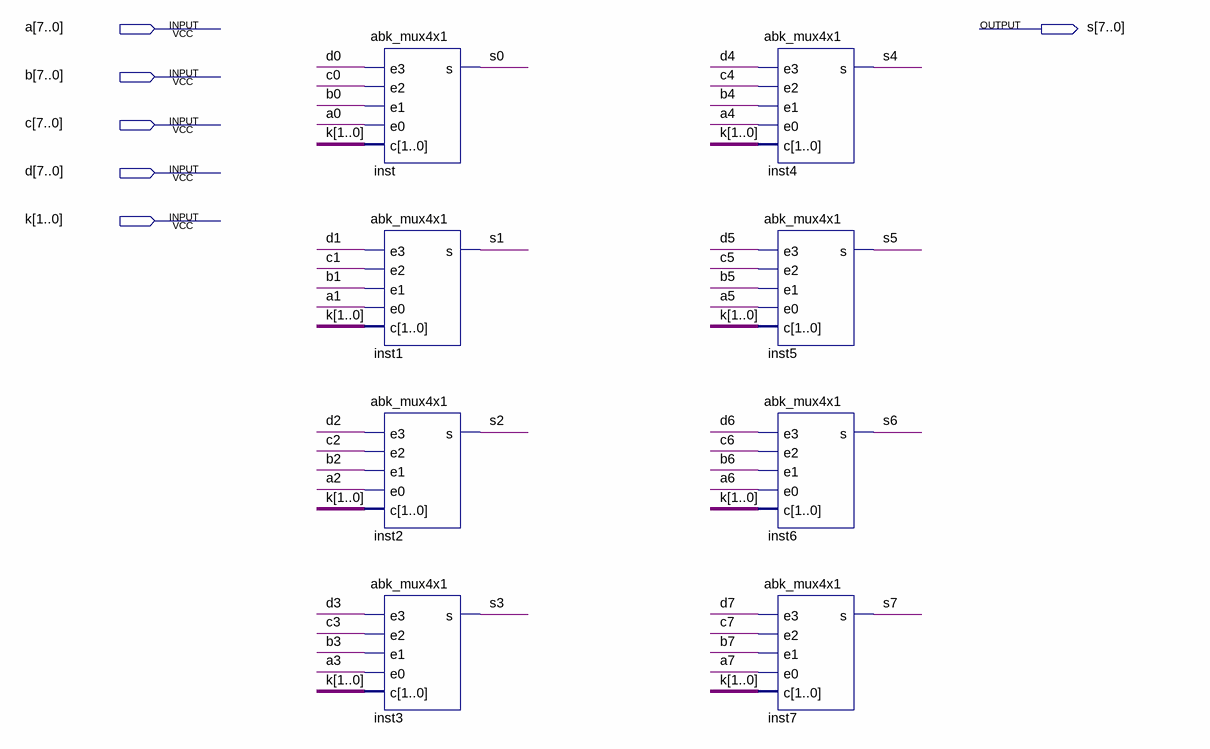
[diagram p0: schematic sheet]
// Quartus schematic abk_mux4x1_8.bdf as structural Verilog: 8 symbols, 6 pins
module abk_mux4x1_8 (
  input  [7:0] a,
  input  [7:0] b,
  input  [7:0] c,
  input  [7:0] d,
  input  [1:0] k,
  output [7:0] s
);

  abk_mux4x1 inst (.e3(d[0]), .e2(c[0]), .e1(b[0]), .e0(a[0]), .c(k), .s(s[0]));
  abk_mux4x1 inst1 (.e3(d[1]), .e2(c[1]), .e1(b[1]), .e0(a[1]), .c(k), .s(s[1]));
  abk_mux4x1 inst2 (.e3(d[2]), .e2(c[2]), .e1(b[2]), .e0(a[2]), .c(k), .s(s[2]));
  abk_mux4x1 inst3 (.e3(d[3]), .e2(c[3]), .e1(b[3]), .e0(a[3]), .c(k), .s(s[3]));
  abk_mux4x1 inst4 (.e3(d[4]), .e2(c[4]), .e1(b[4]), .e0(a[4]), .c(k), .s(s[4]));
  abk_mux4x1 inst5 (.e3(d[5]), .e2(c[5]), .e1(b[5]), .e0(a[5]), .c(k), .s(s[5]));
  abk_mux4x1 inst6 (.e3(d[6]), .e2(c[6]), .e1(b[6]), .e0(a[6]), .c(k), .s(s[6]));
  abk_mux4x1 inst7 (.e3(d[7]), .e2(c[7]), .e1(b[7]), .e0(a[7]), .c(k), .s(s[7]));
endmodule
